# Altium schematic sheet OmapSystem.SchDoc
size A4
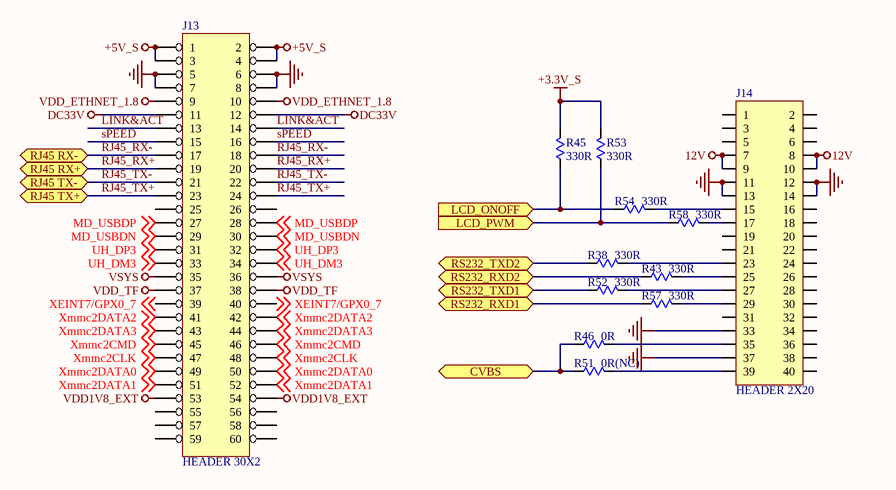
[diagram p0: OmapSystem.SchDoc]

## Parts
J13  HEADER 30X2  [HD2X30-2.00]
J14  HEADER 2X20  [HD2X20-2.00]
R38  330R  [R1206]
R43  330R  [R1206]
R45  330R  [R1206]
R46  0R  [R1206]
R51  0R(NC)  [R1206]
R52  330R  [R1206]
R53  330R  [R1206]
R54  330R  [R1206]
R57  330R  [R1206]
R58  330R  [R1206]

## Ports
CVBS (bidir), LCD_ONOFF (in), LCD_PWM (in), RJ45 RX+ (bidir), RJ45 RX- (bidir), RJ45 TX+ (bidir), RJ45 TX- (bidir), RS232_RXD1 (bidir), RS232_RXD2 (bidir), RS232_TXD1 (bidir), RS232_TXD2 (bidir)

## Nets
12V: J14.7 J14.8 J14.9 J14.10
+3.3V_S: R45.1 R53.1
+5V_S: J13.1 J13.2 J13.3 J13.4
DC33V: J13.11 J13.12
SGND: J13.5 J13.6 J13.7 J13.8 J14.11 J14.12 J14.13 J14.14 J14.33 J14.37
VDD1V8_EXT: J13.53 J13.54
VDD_ETHNET_1.8: J13.9 J13.10
VDD_TF: J13.37 J13.38
VSYS: J13.35 J13.36
CVBS: R46.2 R51.2 ; port CVBS
LCD_ONOFF: R45.2 R54.2 ; port LCD_ONOFF
LCD_PWM: R53.2 R58.2 ; port LCD_PWM
LINK&ACT: J13.13 J13.14
MD_USBDN: J13.29 J13.30 ; off-sheet MD_USBDN
MD_USBDP: J13.27 J13.28 ; off-sheet MD_USBDP
RJ45_RX+: J13.19 J13.20 ; port RJ45 RX+
RJ45_RX-: J13.17 J13.18 ; port RJ45 RX-
RJ45_TX+: J13.23 J13.24 ; port RJ45 TX+
RJ45_TX-: J13.21 J13.22 ; port RJ45 TX-
RS232_RXD1: R57.2 ; port RS232_RXD1
RS232_RXD2: R43.2 ; port RS232_RXD2
RS232_TXD1: R52.2 ; port RS232_TXD1
RS232_TXD2: R38.2 ; port RS232_TXD2
sPEED: J13.15 J13.16
UH_DM3: J13.33 J13.34 ; off-sheet UH_DM3
UH_DP3: J13.31 J13.32 ; off-sheet UH_DP3
XEINT7/GPX0_7: J13.39 J13.40 ; off-sheet XEINT7/GPX0_7
Xmmc2CLK: J13.47 J13.48 ; off-sheet Xmmc2CLK
Xmmc2CMD: J13.45 J13.46 ; off-sheet Xmmc2CMD
Xmmc2DATA0: J13.49 J13.50 ; off-sheet Xmmc2DATA0
Xmmc2DATA1: J13.51 J13.52 ; off-sheet Xmmc2DATA1
Xmmc2DATA2: J13.41 J13.42 ; off-sheet Xmmc2DATA2
Xmmc2DATA3: J13.43 J13.44 ; off-sheet Xmmc2DATA3
NetJ14_15: J14.15 R54.1
NetJ14_17: J14.17 R58.1
NetJ14_23: J14.23 R38.1
NetJ14_25: J14.25 R43.1
NetJ14_27: J14.27 R52.1
NetJ14_29: J14.29 R57.1
NetJ14_35: J14.35 R46.1
NetJ14_39: J14.39 R51.1

Not connected (* = marked no-connect by the designer): J13 25 26 55 56 57 58 59 60; J14 1 2 3 4 5 6 16 18 19 20 21 22 24 26 28 30 31 32 34 36 38 40

## Library data of the parts
R38 R43 R45 R46 R51-R54 R57 R58 = Res: Resistor; Published: 8-Jun-2000; LatestRevisionDate: 04-Mar-2005; LatestRevisionNote: PCB Footprint replaced.; PackageReference: J1-0603; Publisher: Altium Limited
  R38 R43 R45 R52-R54 R57 R58: Value: 330R
  R46: Value: 0R
  R51: Value: 0R(NC)